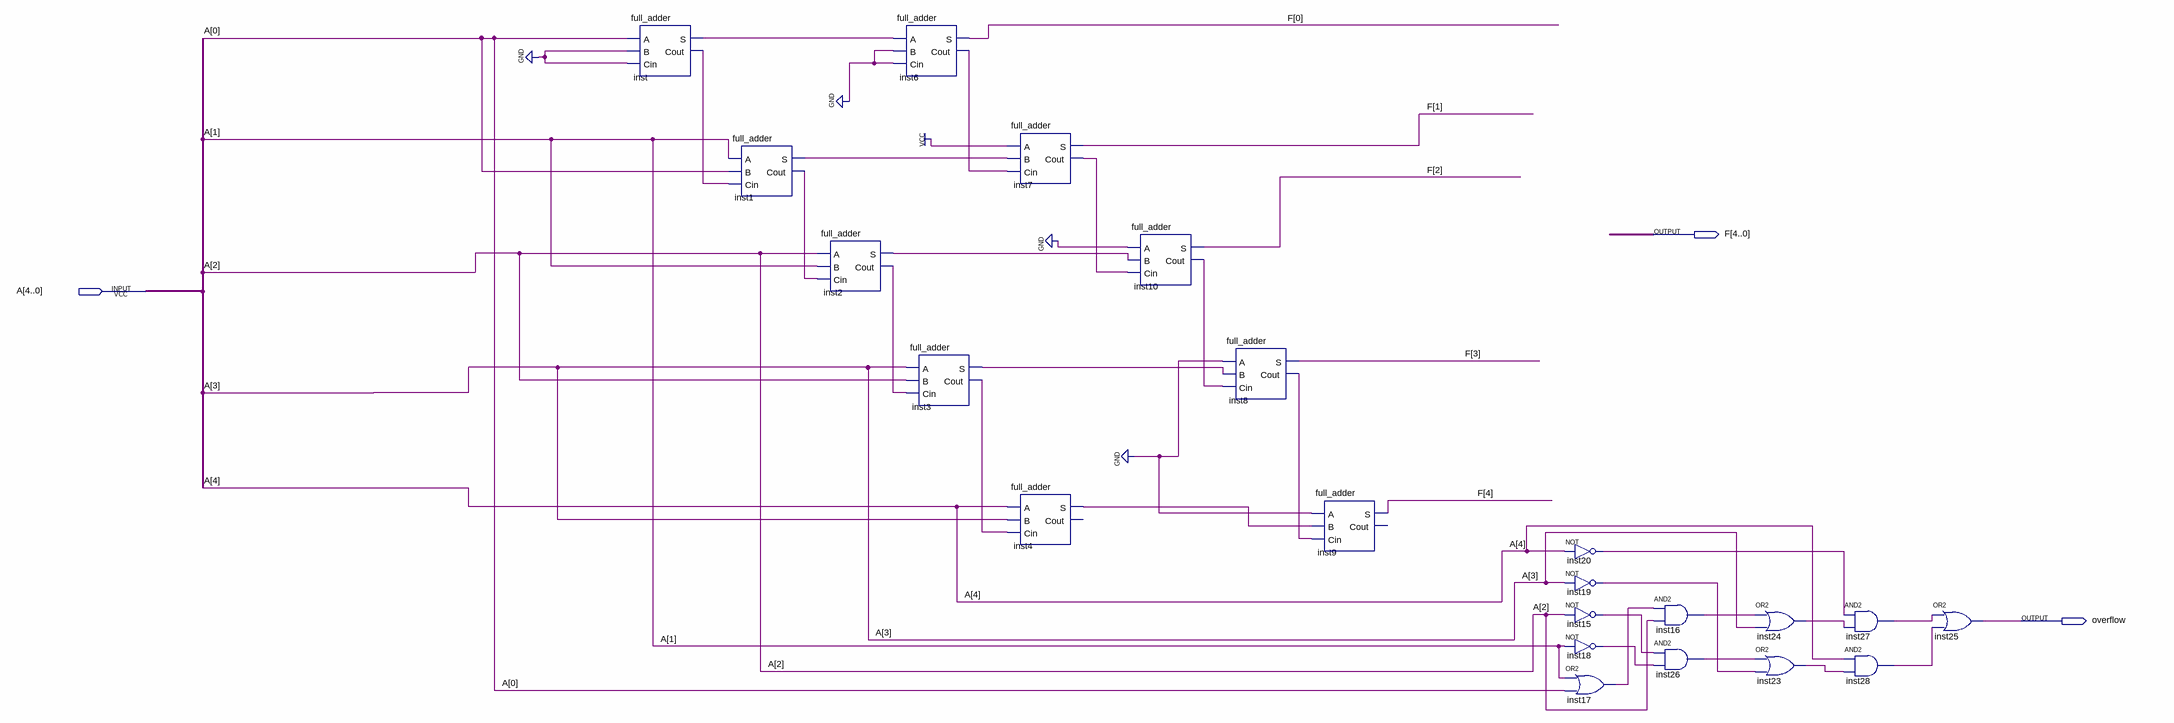
[diagram p0: schematic sheet]
// Quartus schematic Aax3_2.bdf as structural Verilog: 22 symbols, 3 pins
module Aax3_2 (
  input  [4:0] A,
  output [4:0] F,
  output overflow
);

  wire inst1_cout, inst1_s, inst2_cout, inst2_s, inst3_cout, inst3_s, inst4_s, inst6_cout, inst7_cout,
       inst8_cout, inst10_cout, inst15_out, inst16_out, inst17_out, inst18_out, inst19_out, inst20_out,
       inst23_out, inst24_out, inst26_out, inst27_out, inst28_out, inst_cout, inst_s;

  full_adder inst (.A(A[0]), .B(1'b0), .Cin(1'b0), .S(inst_s), .Cout(inst_cout));
  full_adder inst1 (.A(A[1]), .B(A[0]), .Cin(inst_cout), .S(inst1_s), .Cout(inst1_cout));
  full_adder inst2 (.A(A[2]), .B(A[1]), .Cin(inst1_cout), .S(inst2_s), .Cout(inst2_cout));
  full_adder inst6 (.A(inst_s), .B(1'b0), .Cin(1'b0), .S(F[0]), .Cout(inst6_cout));
  full_adder inst3 (.A(A[3]), .B(A[2]), .Cin(inst2_cout), .S(inst3_s), .Cout(inst3_cout));
  full_adder inst7 (.A(1'b1), .B(inst1_s), .Cin(inst6_cout), .S(F[1]), .Cout(inst7_cout));
  full_adder inst4 (.A(A[4]), .B(A[3]), .Cin(inst3_cout), .S(inst4_s));  // open: Cout
  full_adder inst10 (.A(1'b0), .B(inst2_s), .Cin(inst7_cout), .S(F[2]), .Cout(inst10_cout));
  full_adder inst8 (.A(1'b0), .B(inst3_s), .Cin(inst10_cout), .S(F[3]), .Cout(inst8_cout));
  full_adder inst9 (.A(1'b0), .B(inst4_s), .Cin(inst8_cout), .S(F[4]));  // open: Cout
  not inst20 (inst20_out, A[4]);
  not inst19 (inst19_out, A[3]);
  not inst15 (inst15_out, A[2]);
  not inst18 (inst18_out, A[1]);
  or inst17 (inst17_out, A[1], A[0]);
  and inst16 (inst16_out, inst17_out, A[2]);
  and inst26 (inst26_out, inst15_out, inst18_out);
  or inst24 (inst24_out, inst16_out, A[3]);
  or inst23 (inst23_out, inst26_out, inst19_out);
  and inst27 (inst27_out, inst20_out, inst24_out);
  and inst28 (inst28_out, A[4], inst23_out);
  or inst25 (overflow, inst27_out, inst28_out);
endmodule
